# EAGLE schematic LC4032V-CPLDbreakout-v1 (EAGLE 5.11)
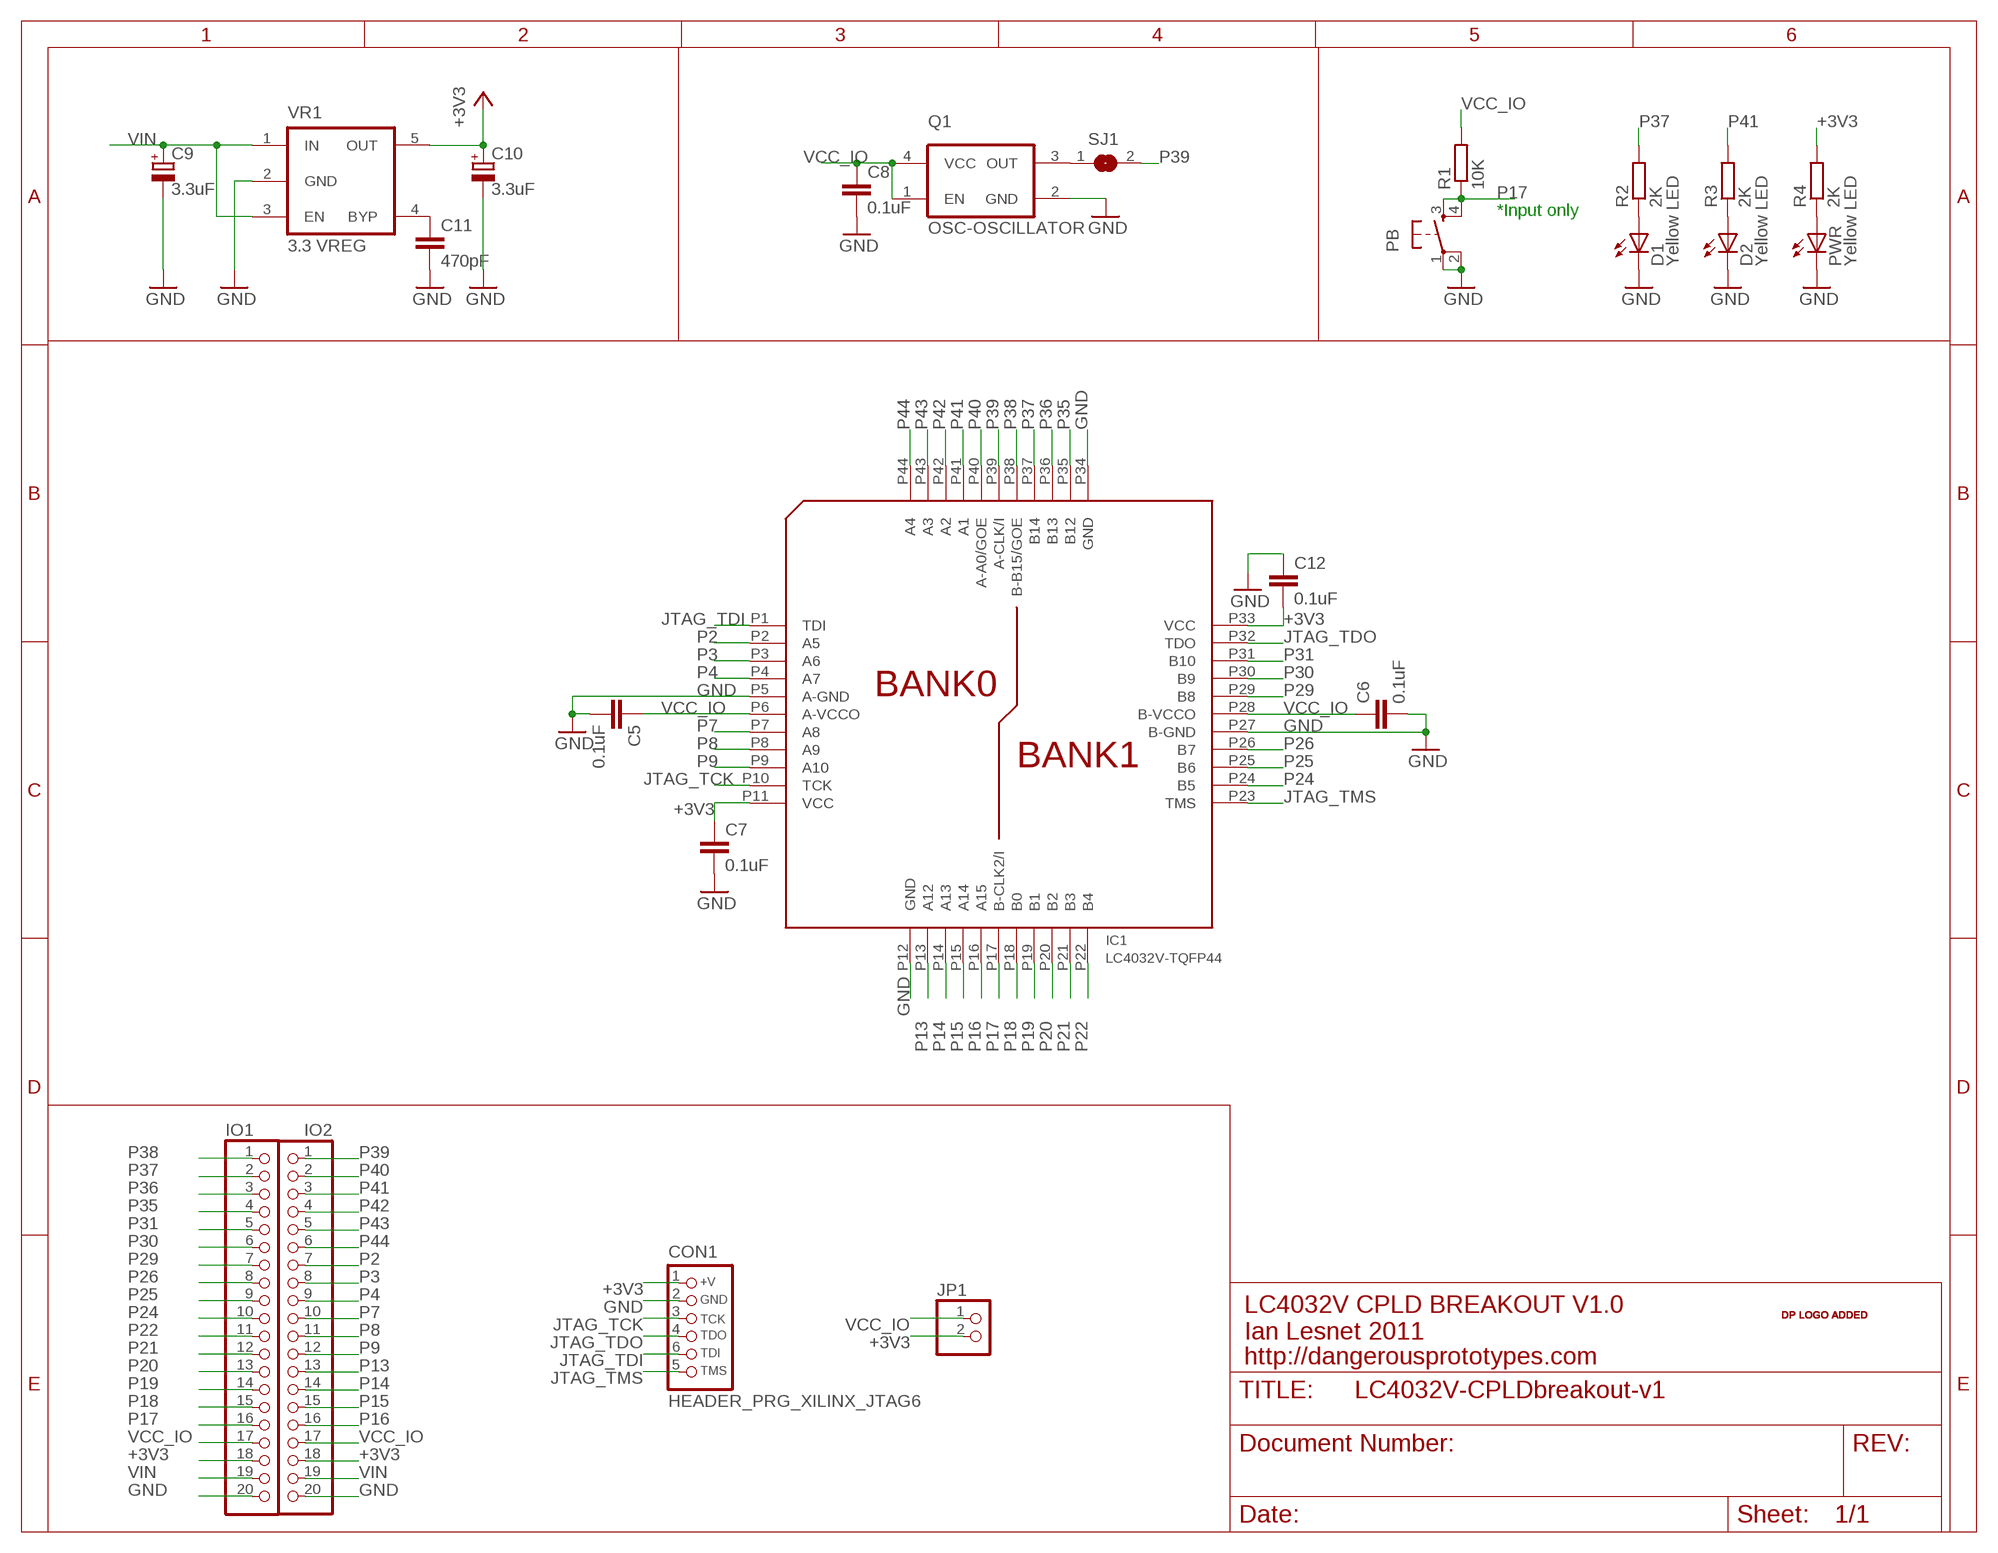
[diagram p0: schematic, sheet 1]

## Parts
C5  0.1uF  CAPC603  [C603]
C6  0.1uF  CAPC603  [C603]
C7  0.1uF  CAPC603  [C603]
C8  0.1uF  CAPC603  [C603]
C9  3.3uF  CAP_POLSMC_A  [SMC_A]
C10  3.3uF  CAP_POLSMC_A  [SMC_A]
C11  470pF  CAPC603  [C603]
C12  0.1uF  CAPC603  [C603]
CON1  HEADER_PRG_XILINX_JTAG6  [HEADER_PRG_1X06]
D1  Yellow LED  LED805  [LED-805]
D2  Yellow LED  LED805  [LED-805]
IC1  LC4032V-TQFP44  [TQFP44]
IO1  PINHD-1X20  [1X20]
IO2  PINHD-1X20  [1X20]
JP1  PINHD-1X02_2.54-S  [1X02-S]
PB  SMD button small  SMD_TACT_SMALL  [TACT_SWITCH_SMALL]
PWR  Yellow LED  LED805  [LED-805]
Q1  OSC-OSCILLATOR  [OSCILLATOR_7X5_SMD]
R1  10K  RESISTORR603  [R603]
R2  2K  RESISTORR603  [R603]
R3  2K  RESISTORR603  [R603]
R4  2K  RESISTORR603  [R603]
SJ1  SJ  [SJ]
U$1  DP_LOGO  [DP_LOGO]
VR1  3.3 VREG  MIC5205  [SOT-23-5]

## Nets
+3V3: C7.1 C10.+ C12.2 CON1.1(+V) IC1.P11(VCC) IC1.P33(VCC) IO1.18 IO2.18 JP1.2 R4.2 VR1.5(OUT)
GND: C5.2 C6.2 C7.2 C8.2 C9.- C10.- C11.2 C12.1 CON1.2(GND) D1.C D2.C IC1.P5(A-GND) IC1.P12(GND) IC1.P27(B-GND) IC1.P34(GND) IO1.20 IO2.20 PB.1 PB.2 PWR.C Q1.2(GND) VR1.2(GND)
JTAG_TCK: CON1.3(TCK) IC1.P10(TCK)
JTAG_TDI: CON1.6(TDI) IC1.P1(TDI)
JTAG_TDO: CON1.4(TDO) IC1.P32(TDO)
JTAG_TMS: CON1.5(TMS) IC1.P23(TMS)
N$1: D1.A R2.1
N$2: D2.A R3.1
N$3: PWR.A R4.1
N$5: Q1.3(OUT) SJ1.1
N$7: C11.1 VR1.4(BYP)
P2: IC1.P2(A5) IO2.7
P3: IC1.P3(A6) IO2.8
P4: IC1.P4(A7) IO2.9
P7: IC1.P7(A8) IO2.10
P8: IC1.P8(A9) IO2.11
P9: IC1.P9(A10) IO2.12
P13: IC1.P13(A12) IO2.13
P14: IC1.P14(A13) IO2.14
P15: IC1.P15(A14) IO2.15
P16: IC1.P16(A15) IO2.16
P17: IC1.P17(B-CLK2/I) IO1.16 PB.3 PB.4 R1.1
P18: IC1.P18(B0) IO1.15
P19: IC1.P19(B1) IO1.14
P20: IC1.P20(B2) IO1.13
P21: IC1.P21(B3) IO1.12
P22: IC1.P22(B4) IO1.11
P24: IC1.P24(B5) IO1.10
P25: IC1.P25(B6) IO1.9
P26: IC1.P26(B7) IO1.8
P29: IC1.P29(B8) IO1.7
P30: IC1.P30(B9) IO1.6
P31: IC1.P31(B10) IO1.5
P35: IC1.P35(B12) IO1.4
P36: IC1.P36(B13) IO1.3
P37: IC1.P37(B14) IO1.2 R2.2
P38: IC1.P38(B-B15/GOE) IO1.1
P39: IC1.P39(A-CLK/I) IO2.1 SJ1.2
P40: IC1.P40(A-A0/GOE) IO2.2
P41: IC1.P41(A1) IO2.3 R3.2
P42: IC1.P42(A2) IO2.4
P43: IC1.P43(A3) IO2.5
P44: IC1.P44(A4) IO2.6
VCC_IO: C5.1 C6.1 C8.1 IC1.P6(A-VCCO) IC1.P28(B-VCCO) IO1.17 IO2.17 JP1.1 Q1.1(EN) Q1.4(VCC) R1.2
VIN: C9.+ IO1.19 IO2.19 VR1.1(IN) VR1.3(EN)

## Notes on the sheet
- *Input only
- LC4032V CPLD BREAKOUT V1.0
- Ian Lesnet 2011
- http://dangerousprototypes.com

## Library data of the parts
C5-C8 C11 C12 = dp_devices:CAP
C9 C10 = dp_devices:CAP_POL
CON1 = dp_devices:HEADER_PRG_XILINX_JTAG6: 6-pin Xilinx JTAG programming header
D1 D2 PWR = dp_devices:LED
IC1 = dp_devices:LC4032V: 32 Macrocells 3.3V CPLD
IO1 IO2 = pinhead:PINHD-1X20: PIN HEADER
JP1 = pinhead-2:PINHD-1X02: PIN HEADER
PB = dp_devices:SMD_TACT_SMALL
Q1 = dp_devices:OSC-OSCILLATOR: Oscillator
R1-R4 = dp_devices:RESISTOR
SJ1 = jumper:SJ: SMD solder JUMPER
U$1 = dp_devices:DP_LOGO; FF1: fullfillment by; FF2: Seeed studio; FF3: www.seeedstudio.com; LICENSE: CC-BY-SA; PROJECT: project; URL1: http://; URL2: DangerousPrototypes.com
VR1 = dp_devices:MIC5205: 150ma Low-Noise LDO Regulator